# Altium schematic sheet POWER.SchDoc
size A3
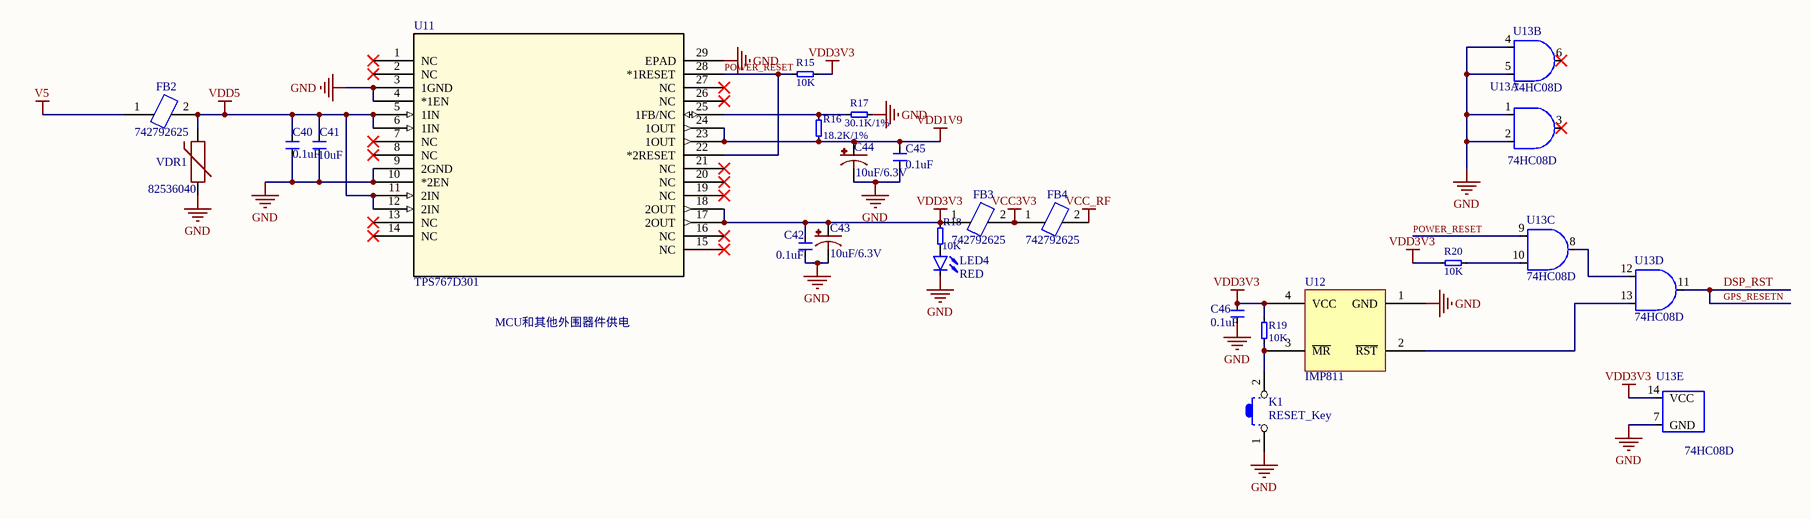
[diagram p0: POWER.SchDoc]

## Parts
C40  0.1uF  [0603C]
C41  10uF  [0603C]
C42  0.1uF  [0603C]
C43  10uF/6.3V  [3216/A]
C44  10uF/6.3V  [3216/A]
C45  0.1uF  [0603C]
C46  0.1uF  [0603C]
FB2  742792625  [0603-FB]
FB3  742792625  [0603-FB]
FB4  742792625  [0603-FB]
K1  RESET_Key  [KEY(2*4*3.5)]
LED4  RED  [0603D]
R15  10K  [0603R]
R16  18.2K/1%  [0603R]
R17  30.1K/1%  [0603R]
R18  10K  [0603R]
R19  10K  [0603R]
R20  10K  [0603R]
U11  TPS767D301  [TPS767D301]
U12  IMP811  [IMP811]
U13  74HC08D  [TSSOP14]  (parts A,B,C,D,E of 5)
VDR1  82536040  [0603R]

## Nets
GND: C40.1 C41.1 C42.1 C43.2 C44.2 C45.1 C46.1 K1.1 LED4.2 R17.1 U11.3(1GND) U11.4(*1EN) U11.9(2GND) U11.10(*2EN) U11.29(EPAD) U12.1(GND) U13.1 U13.2 U13.4 U13.5 U13.7(GND) VDR1.1
V5: FB2.1
VCC3V3: FB3.2 FB4.1
VCC_RF: FB4.2
VDD1V9: C44.1 C45.2 R16.1 U11.23(1OUT) U11.24(1OUT)
VDD3V3: C42.2 C43.1 C46.2 FB3.1 R15.2 R18.2 R19.2 R20.2 U11.17(2OUT) U11.18(2OUT) U12.4(VCC) U13.14(VCC)
VDD5: C40.2 C41.2 FB2.2 U11.5(1IN) U11.6(1IN) U11.11(2IN) U11.12(2IN) VDR1.2
DSP_RST: U13.11  [also labelled GPS_RESETN]
POWER_RESET: R15.1 U11.22(*2RESET) U11.28(*1RESET) U13.9
NetK1_2: K1.2 R19.1 U12.3(~{MR})
NetLED4_1: LED4.1 R18.1
NetR16_2: R16.2 R17.2 U11.25(1FB/NC)
NetR20_1: R20.1 U13.10
NetU12_2: U12.2(~{RST}) U13.13
NetU13_8: U13.8 U13.12

Not connected (* = marked no-connect by the designer): U11 1(NC)* 2(NC)* 7(NC)* 8(NC)* 13(NC)* 14(NC)* 15(NC)* 16(NC)* 19(NC)* 20(NC)* 21(NC)* 26(NC)* 27(NC)*; U13 3* 6*

## Notes on the sheet
- MCU和其他外围器件供电

## Library data of the parts
C40-C42 C45 C46 = C
C43 C44 = C-POLAR
FB2-FB4 = FB
LED4 = LED
R15-R20 = R
U13 = 74HC08D: 2-INPUT AND GATE
VDR1 = Varistor